# EAGLE design Power_Amp_V2.0 (EAGLE 6.5.0)
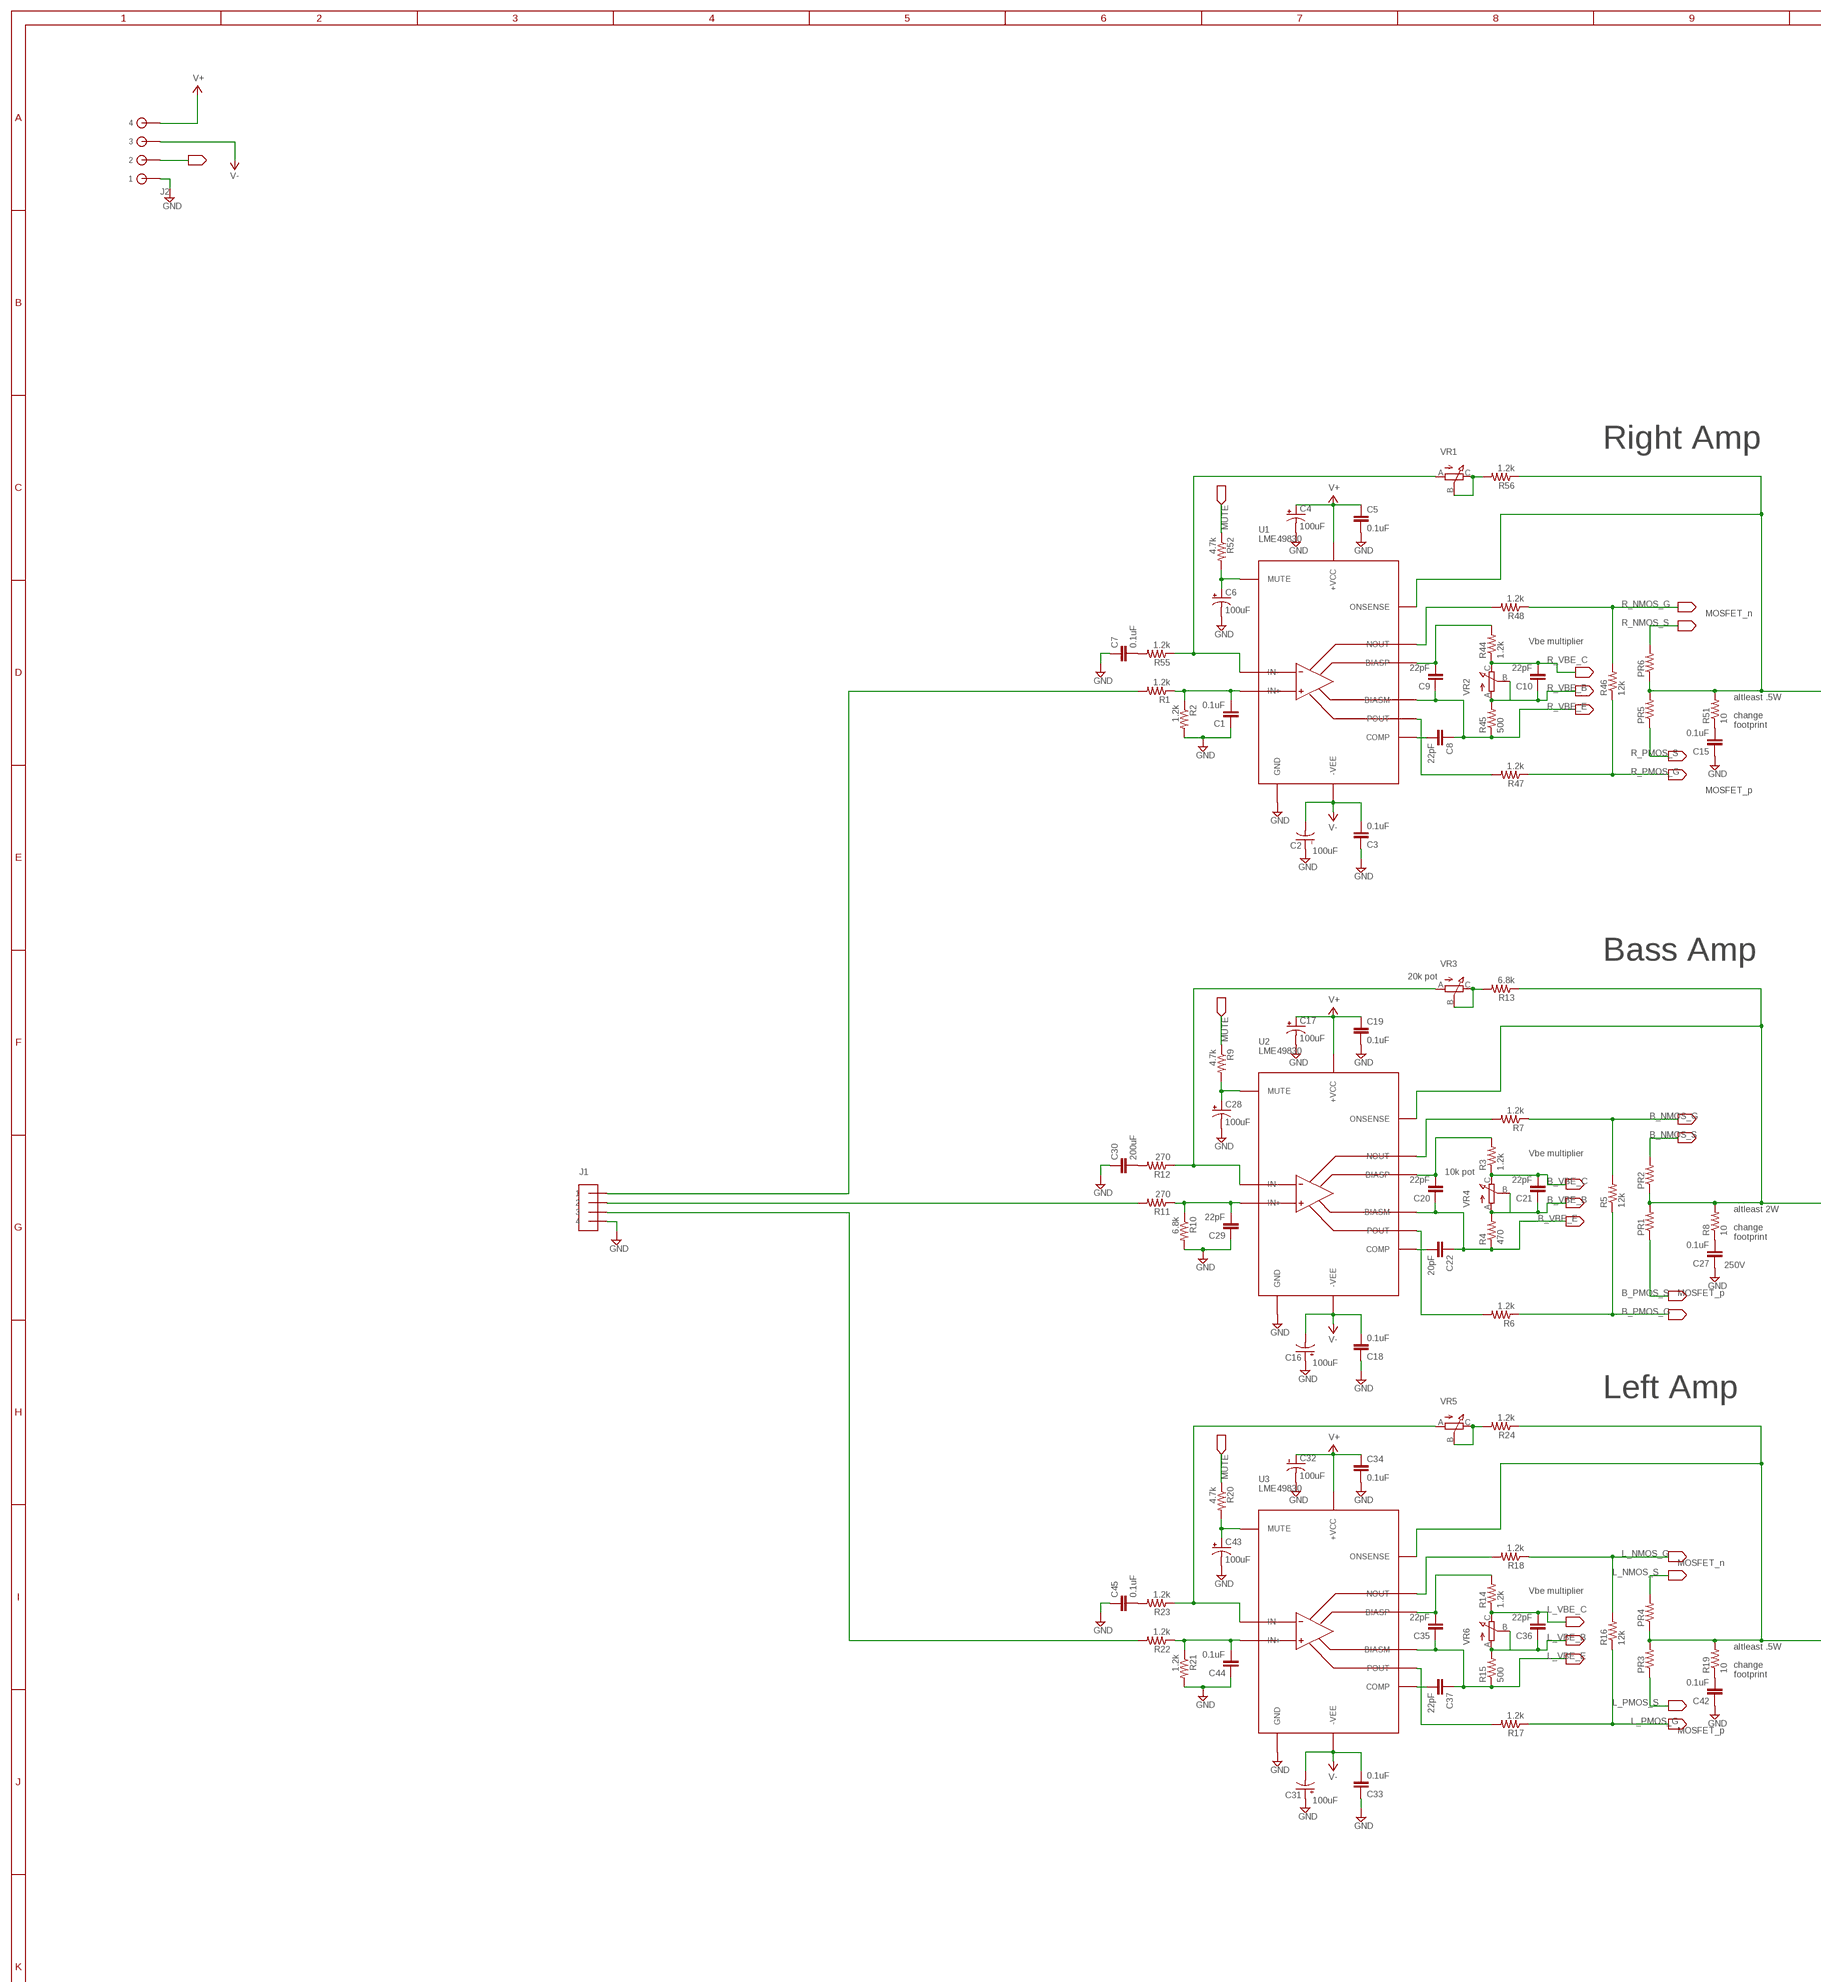
[diagram p0: schematic, sheet 1, part 1 of 3]
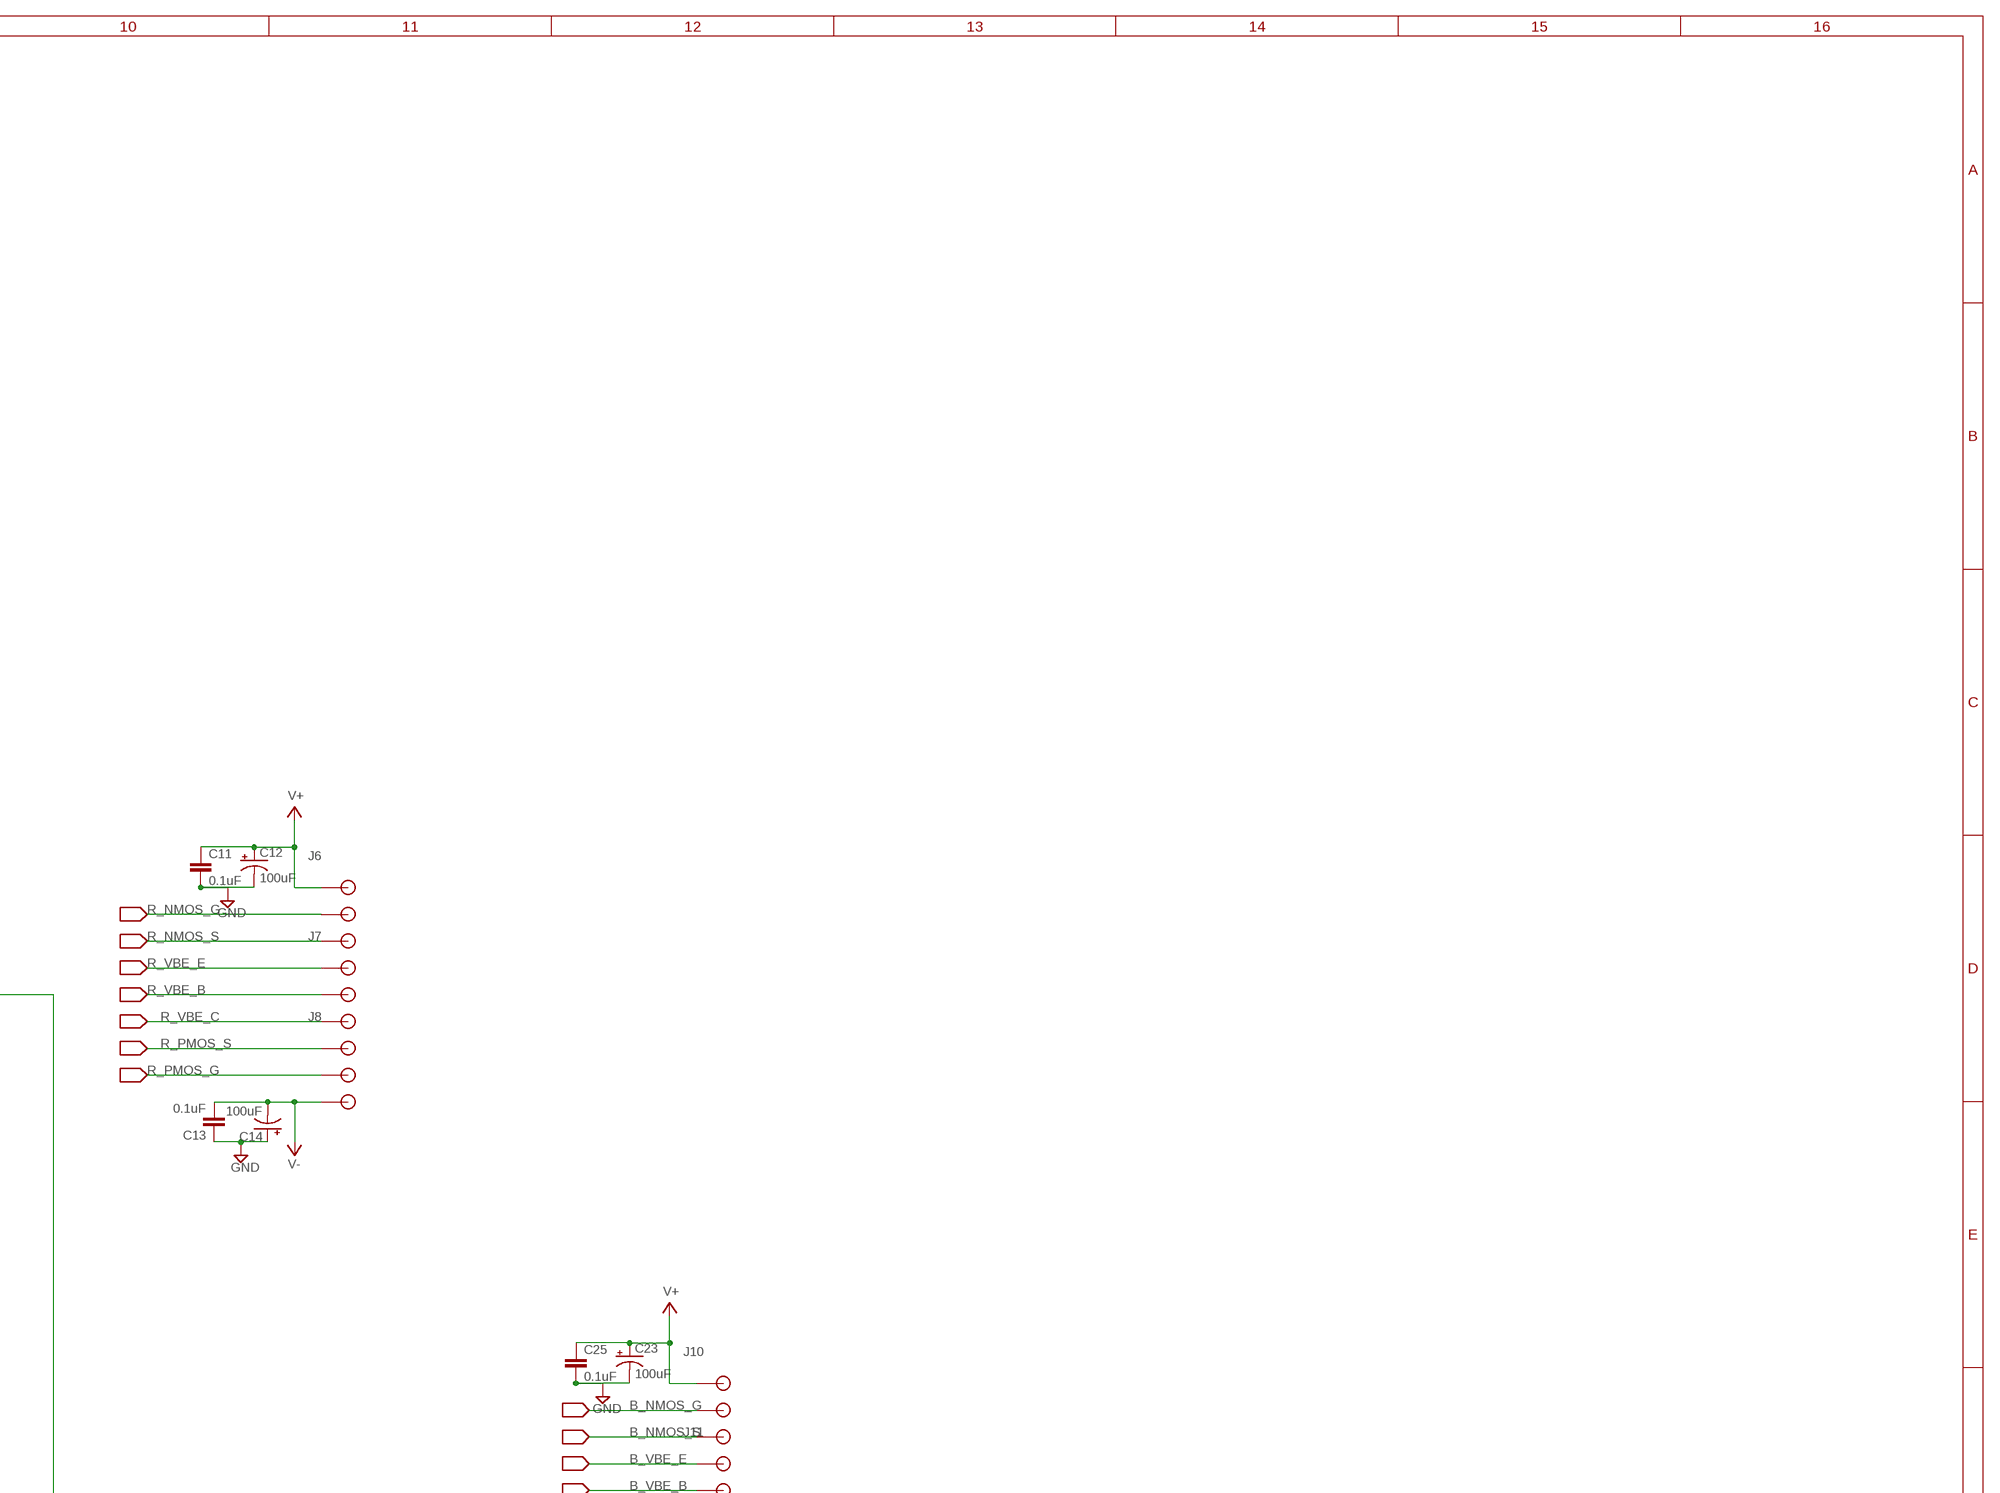
[diagram p1: schematic, sheet 1, part 2 of 3]
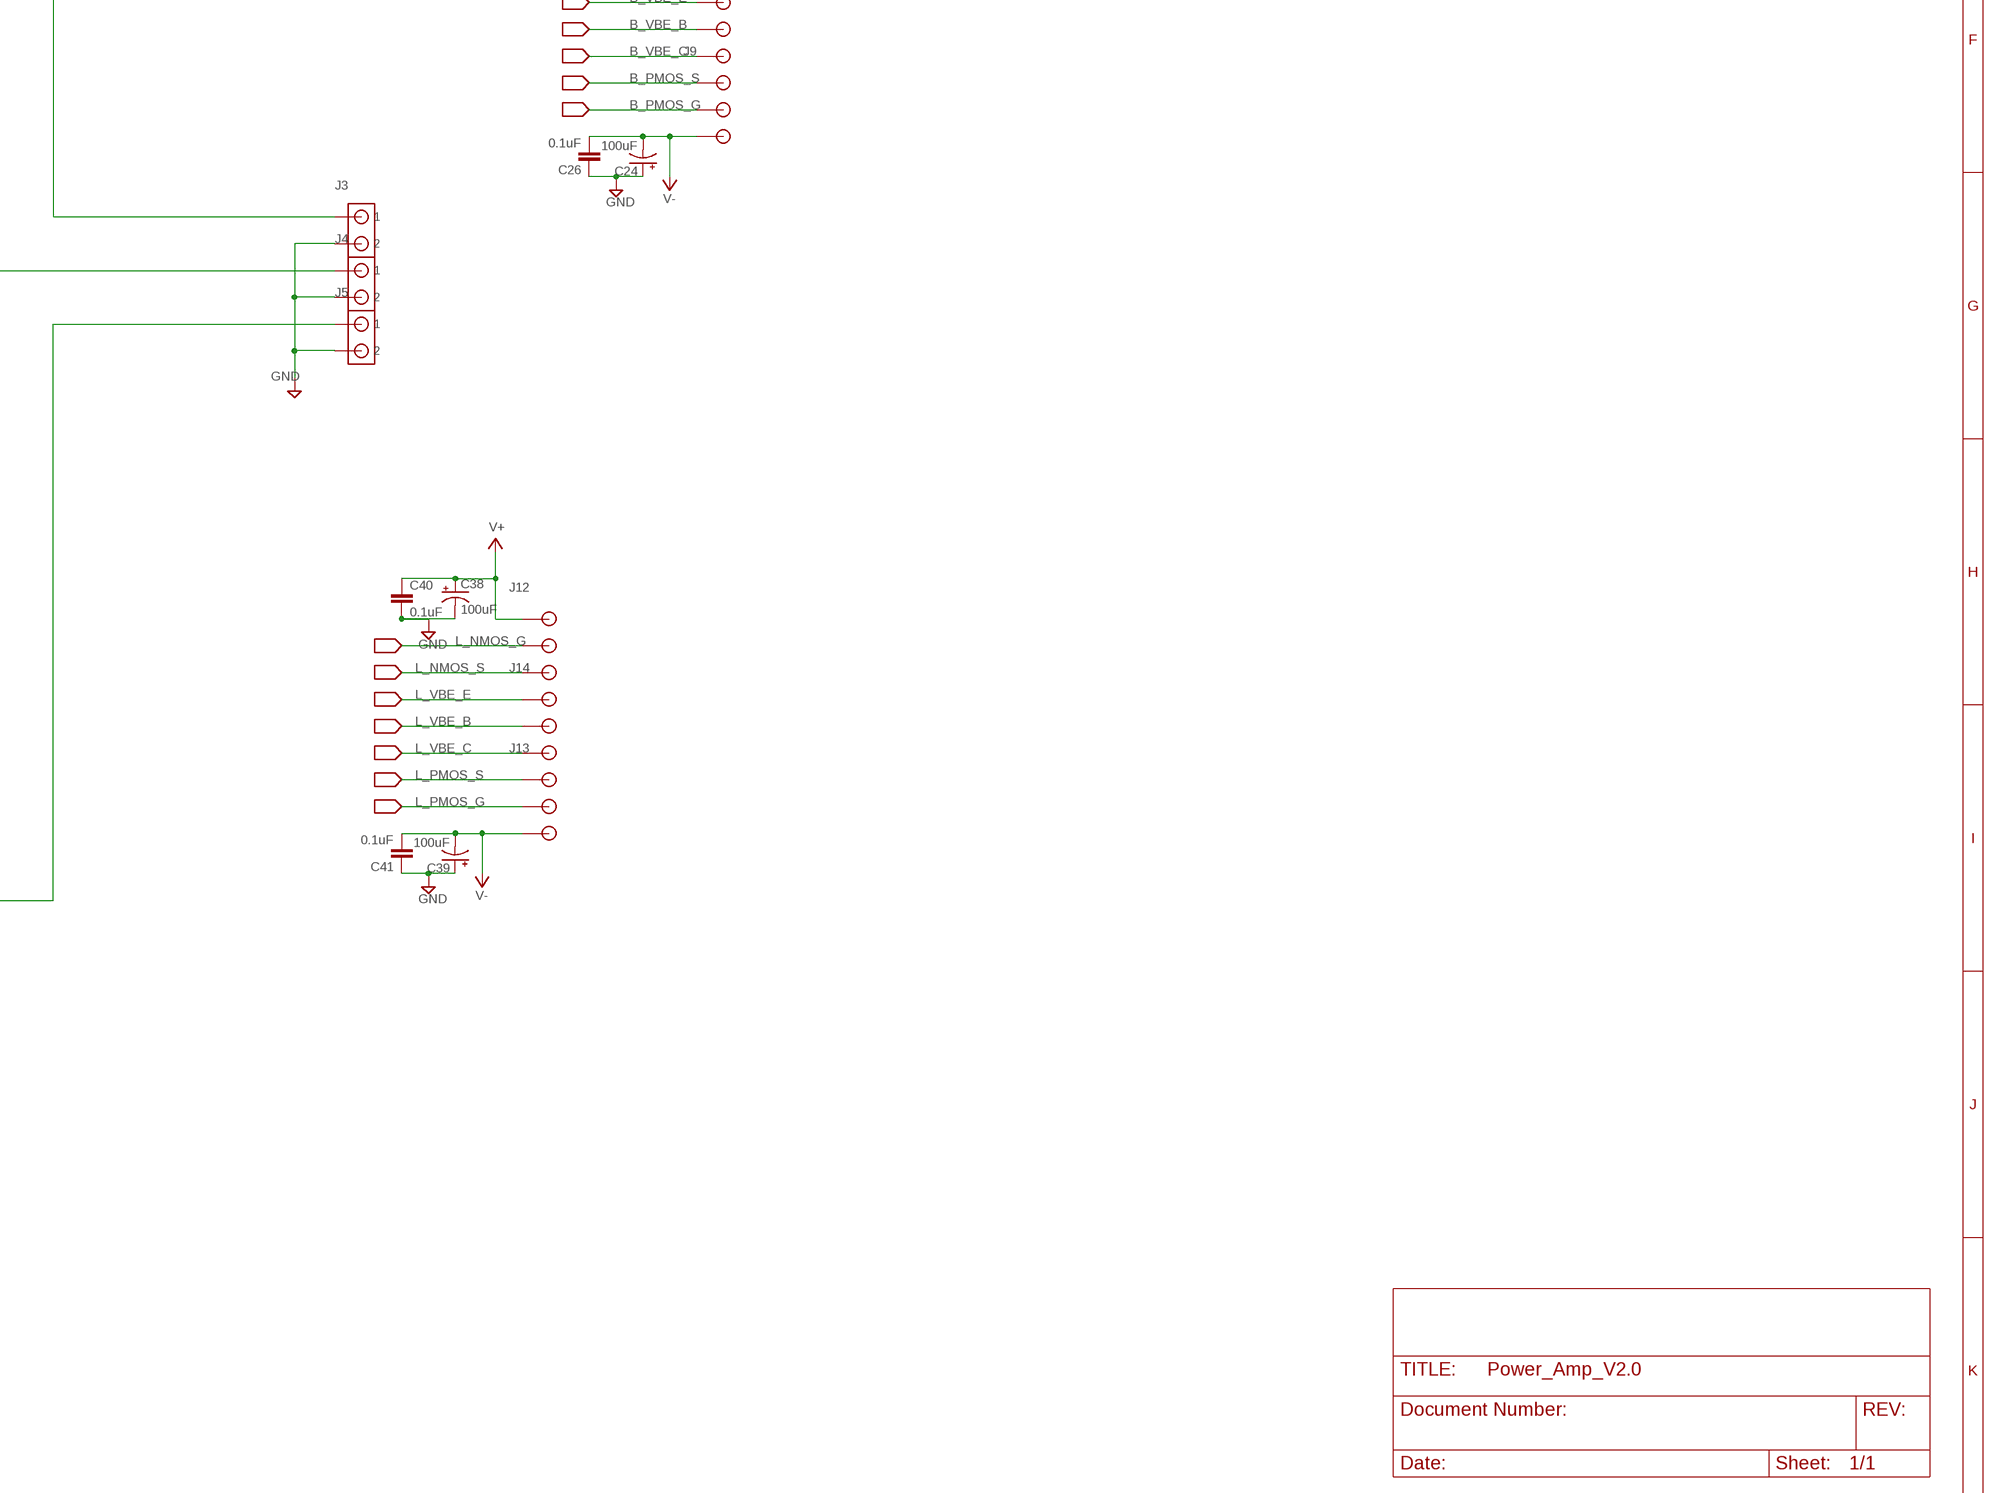
[diagram p2: schematic, sheet 1, part 3 of 3]

## Parts
C1  0.1uF  C-EU050-024X044  [C050-024X044]
C2  100uF  CPOL-USE2.5-6  [E2,5-6]
C3  0.1uF  C-EU050-024X044  [C050-024X044]
C4  100uF  CPOL-USE2.5-6  [E2,5-6]
C5  0.1uF  C-EU050-024X044  [C050-024X044]
C6  100uF  CPOL-USE2.5-6  [E2,5-6]
C7  0.1uF  C-EU050-024X044  [C050-024X044]
C8  22pF  C-EU050-024X044  [C050-024X044]
C9  22pF  C-EU050-024X044  [C050-024X044]
C10  22pF  C-EU050-024X044  [C050-024X044]
C11  0.1uF  C-EU050-024X044  [C050-024X044]
C12  100uF  CPOL-USE2.5-6  [E2,5-6]
C13  0.1uF  C-EU050-024X044  [C050-024X044]
C14  100uF  CPOL-USE2.5-6  [E2,5-6]
C15  0.1uF  C-EU050-024X044  [C050-024X044]
C16  100uF  CPOL-USE2.5-6  [E2,5-6]
C17  100uF  CPOL-USE2.5-6  [E2,5-6]
C18  0.1uF  C-EU050-024X044  [C050-024X044]
C19  0.1uF  C-EU050-024X044  [C050-024X044]
C20  22pF  C-EU050-024X044  [C050-024X044]
C21  22pF  C-EU050-024X044  [C050-024X044]
C22  20pF  C-EU050-024X044  [C050-024X044]
C23  100uF  CPOL-USE2.5-6  [E2,5-6]
C24  100uF  CPOL-USE2.5-6  [E2,5-6]
C25  0.1uF  C-EU050-024X044  [C050-024X044]
C26  0.1uF  C-EU050-024X044  [C050-024X044]
C27  0.1uF  C-EU050-024X044  [C050-024X044]
C28  100uF  CPOL-USE2.5-6  [E2,5-6]
C29  22pF  C-EU050-024X044  [C050-024X044]
C30  200uF  C-EU050-024X044  [C050-024X044]
C31  100uF  CPOL-USE2.5-6  [E2,5-6]
C32  100uF  CPOL-USE2.5-6  [E2,5-6]
C33  0.1uF  C-EU050-024X044  [C050-024X044]
C34  0.1uF  C-EU050-024X044  [C050-024X044]
C35  22pF  C-EU050-024X044  [C050-024X044]
C36  22pF  C-EU050-024X044  [C050-024X044]
C37  22pF  C-EU050-024X044  [C050-024X044]
C38  100uF  CPOL-USE2.5-6  [E2,5-6]
C39  100uF  CPOL-USE2.5-6  [E2,5-6]
C40  0.1uF  C-EU050-024X044  [C050-024X044]
C41  0.1uF  C-EU050-024X044  [C050-024X044]
C42  0.1uF  C-EU050-024X044  [C050-024X044]
C43  100uF  CPOL-USE2.5-6  [E2,5-6]
C44  0.1uF  C-EU050-024X044  [C050-024X044]
C45  0.1uF  C-EU050-024X044  [C050-024X044]
J1  4_PIN_AMPCONN  [4_PIN_AMPCON]
J2  1984633  [1984633]
J3  2TERMINAL_SPEAKER  [2TERMINAL_SPEAKER]
J4  2TERMINAL_SPEAKER  [2TERMINAL_SPEAKER]
J5  2TERMINAL_SPEAKER  [2TERMINAL_SPEAKER]
J6  OSTVN03A150  [OSTVN03A150]
J7  OSTVN03A150  [OSTVN03A150]
J8  OSTVN03A150  [OSTVN03A150]
J9  OSTVN03A150  [OSTVN03A150]
J10  OSTVN03A150  [OSTVN03A150]
J11  OSTVN03A150  [OSTVN03A150]
J12  OSTVN03A150  [OSTVN03A150]
J13  OSTVN03A150  [OSTVN03A150]
J14  OSTVN03A150  [OSTVN03A150]
PR1  R-US_0617/5V  [0617V]
PR2  R-US_0617/5V  [0617V]
PR3  R-US_0617/5V  [0617V]
PR4  R-US_0617/5V  [0617V]
PR5  R-US_0617/5V  [0617V]
PR6  R-US_0617/5V  [0617V]
R1  1.2k  R-US_0204/2V  [0204V]
R2  1.2k  R-US_0204/2V  [0204V]
R3  1.2k  R-US_0204/2V  [0204V]
R4  470  R-US_0204/2V  [0204V]
R5  12k  R-US_0204/2V  [0204V]
R6  1.2k  R-US_0204/2V  [0204V]
R7  1.2k  R-US_0204/2V  [0204V]
R8  10  R-US_0309/V  [0309V]
R9  4.7k  R-US_0204/2V  [0204V]
R10  6.8k  R-US_0204/2V  [0204V]
R11  270  R-US_0204/2V  [0204V]
R12  270  R-US_0204/2V  [0204V]
R13  6.8k  R-US_0204/2V  [0204V]
R14  1.2k  R-US_0204/2V  [0204V]
R15  500  R-US_0204/2V  [0204V]
R16  12k  R-US_0204/2V  [0204V]
R17  1.2k  R-US_0204/2V  [0204V]
R18  1.2k  R-US_0204/2V  [0204V]
R19  10  R-US_0309/V  [0309V]
R20  4.7k  R-US_0204/2V  [0204V]
R21  1.2k  R-US_0204/2V  [0204V]
R22  1.2k  R-US_0204/2V  [0204V]
R23  1.2k  R-US_0204/2V  [0204V]
R24  1.2k  R-US_0204/2V  [0204V]
R44  1.2k  R-US_0204/2V  [0204V]
R45  500  R-US_0204/2V  [0204V]
R46  12k  R-US_0204/2V  [0204V]
R47  1.2k  R-US_0204/2V  [0204V]
R48  1.2k  R-US_0204/2V  [0204V]
R51  10  R-US_0309/V  [0309V]
R52  4.7k  R-US_0204/2V  [0204V]
R55  1.2k  R-US_0204/2V  [0204V]
R56  1.2k  R-US_0204/2V  [0204V]
U1  LME49830  [NDN0015A]
U2  LME49830  [NDN0015A]
U3  LME49830  [NDN0015A]
VR1  EVM2W  [EVM2W]
VR2  EVM2W  [EVM2W]
VR3  EVM2W  [EVM2W]
VR4  EVM2W  [EVM2W]
VR5  EVM2W  [EVM2W]
VR6  EVM2W  [EVM2W]

## Nets
B_NMOS_G: J10.P$2 R5.2 R7.1
B_NMOS_S: J10.P$3 PR2.2
B_PMOS_G: J9.P$2 R5.1 R6.1
B_PMOS_S: J9.P$1 PR1.1
B_VBE_B: C21.1 J11.P$2 R4.2 VR4.A VR4.B
B_VBE_C: C21.2 J11.P$3 R3.1 VR4.C
B_VBE_E: C20.1 C22.1 J11.P$1 R4.1 U2.P11(BIASM)
BASS_IN: J1.2 R11.2
BASS_OUT: J4.P$1 PR1.2 PR2.1 R8.2 R13.1 U2.P$8(ONSENSE)
GND: C1.1 C2.+ C3.1 C4.- C5.2 C6.- C7.1 C11.2 C12.- C13.1 C14.+ C15.1 C16.+ C17.- C18.1 C19.2 C23.- C24.+ C25.2 C26.1 C27.1 C28.- C29.1 C30.1 C31.+ C32.- C33.1 C34.2 C38.- C39.+ C40.2 C41.1 C42.1 C43.- C44.1 C45.1 J1.4 J2.P$1 J3.P$2 J4.P$2 J5.P$2 R2.2 R10.2 R21.2 U1.P3(GND) U2.P3(GND) U3.P3(GND)
L_NMOS_G: J12.P$2 R16.2 R18.1
L_NMOS_S: J12.P$3 PR4.2
L_PMOS_G: J13.P$2 R16.1 R17.1
L_PMOS_S: J13.P$1 PR3.1
L_VBE_B: C36.1 J14.P$2 R15.2 VR6.A VR6.B
L_VBE_C: C36.2 J14.P$3 R14.1 VR6.C
L_VBE_E: C35.1 C37.1 J14.P$1 R15.1 U3.P11(BIASM)
LEFT_IN: J1.3 R22.2
LEFT_OUT: J5.P$1 PR3.2 PR4.1 R19.2 R24.1 U3.P$8(ONSENSE)
MUTE: J2.P$2 R9.1 R20.1 R52.1
N$3: C20.2 R3.2 U2.P12(BIASP)
N$4: R48.2 U1.P14(NOUT)
N$6: C22.2 U2.P6(COMP)
N$7: R6.2 U2.P13(POUT)
N$13: C27.2 R8.1
N$14: C28.+ R9.2 U2.P2(MUTE)
N$15: R7.2 U2.P14(NOUT)
N$16: C1.2 R1.1 R2.1 U1.P4(IN+)
N$17: C29.2 R10.1 R11.1 U2.P4(IN+)
N$18: C30.2 R12.2
N$19: R12.1 U2.P5(IN-) VR3.A
N$20: R13.2 VR3.B VR3.C
N$25: C35.2 R14.2 U3.P12(BIASP)
N$27: C37.2 U3.P6(COMP)
N$28: R17.2 U3.P13(POUT)
N$31: R55.1 U1.P5(IN-) VR1.A
N$35: C42.2 R19.1
N$36: C7.2 R55.2
N$37: C43.+ R20.2 U3.P2(MUTE)
N$38: R18.2 U3.P14(NOUT)
N$39: C44.2 R21.1 R22.1 U3.P4(IN+)
N$40: R56.2 VR1.B VR1.C
N$41: C45.2 R23.2
N$42: R23.1 U3.P5(IN-) VR5.A
N$43: R24.2 VR5.B VR5.C
N$66: C8.2 U1.P6(COMP)
N$69: C9.2 R44.2 U1.P12(BIASP)
N$70: R47.2 U1.P13(POUT)
N$84: C15.2 R51.1
N$85: C6.+ R52.2 U1.P2(MUTE)
R_NMOS_G: J6.P$2 R46.2 R48.1
R_NMOS_S: J6.P$3 PR6.2
R_PMOS_G: J8.P$2 R46.1 R47.1
R_PMOS_S: J8.P$1 PR5.1
R_VBE_B: C10.1 J7.P$2 R45.2 VR2.A VR2.B
R_VBE_C: C10.2 J7.P$3 R44.1 VR2.C
R_VBE_E: C8.1 C9.1 J7.P$1 R45.1 U1.P11(BIASM)
RIGHT_IN: J1.1 R1.2
RIGHT_OUT: J3.P$1 PR5.2 PR6.1 R51.2 R56.1 U1.P$8(ONSENSE)
V+: C4.+ C5.1 C11.1 C12.+ C17.+ C19.1 C23.+ C25.1 C32.+ C34.1 C38.+ C40.1 J2.P$4 J6.P$1 J10.P$1 J12.P$1 U1.P15(+VCC) U2.P15(+VCC) U3.P15(+VCC)
V-: C2.- C3.2 C13.2 C14.- C16.- C18.2 C24.- C26.2 C31.- C33.2 C39.- C41.2 J2.P$3 J8.P$3 J9.P$3 J13.P$3 U1.P10(-VEE) U2.P10(-VEE) U3.P10(-VEE)

## Notes on the sheet
- Right Amp
- MOSFET_n
- Vbe multiplier
- altleast .5W
- change
  footprint
- MOSFET_p
- Bass Amp
- 20k pot
- Vbe multiplier
- 10k pot
- altleast 2W
- change
  footprint
- 250V
- MOSFET_p
- Left Amp
- MOSFET_n
- Vbe multiplier
- altleast .5W
- change
  footprint
- MOSFET_p

## Library data of the parts
C1 C3 C5 C7-C11 C13 C15 C18-C22 C25-C27 C29 C30 C33-C37 C40-C42 C44 C45 = rcl:C-EU: CAPACITOR, European symbol
C2 C4 C6 C12 C14 C16 C17 C23 C24 C28 C31 C32 C38 C39 C43 = rcl:CPOL-US: POLARIZED CAPACITOR, American symbol
J1 = Amplifier_Parts:4_PIN_AMPCONN
J2 = Amplifier_Parts:1984633
J3-J5 = Amplifier_Parts:2TERMINAL_SPEAKER
J6-J14 = Amplifier_Parts:OSTVN03A150
PR1-PR6 R1-R24 R44-R48 R51 R52 R55 R56 = rcl:R-US_: RESISTOR, American symbol
U1-U3 = LME49830_1:LME49830: Mono High Fidelity 200 Volt MOSFET Power Amplifier Input Stage with Mute Datasheet: http://www.ti.com/lit/ds/symlink/lme49830.pdf
VR1-VR6 = Amplifier_Parts:EVM2W

## Board
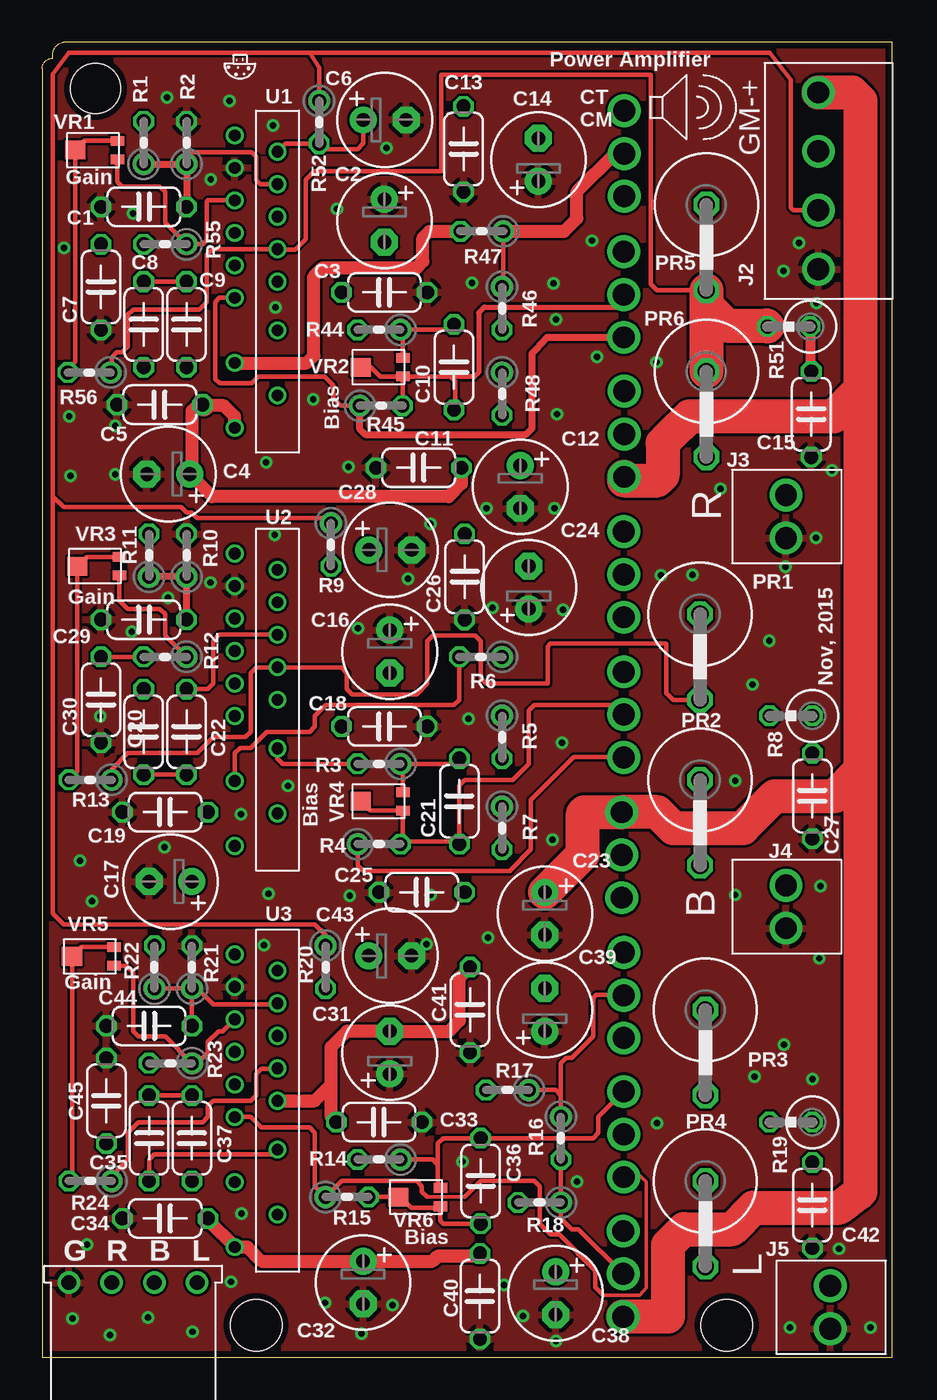
[diagram p3: board, top side]
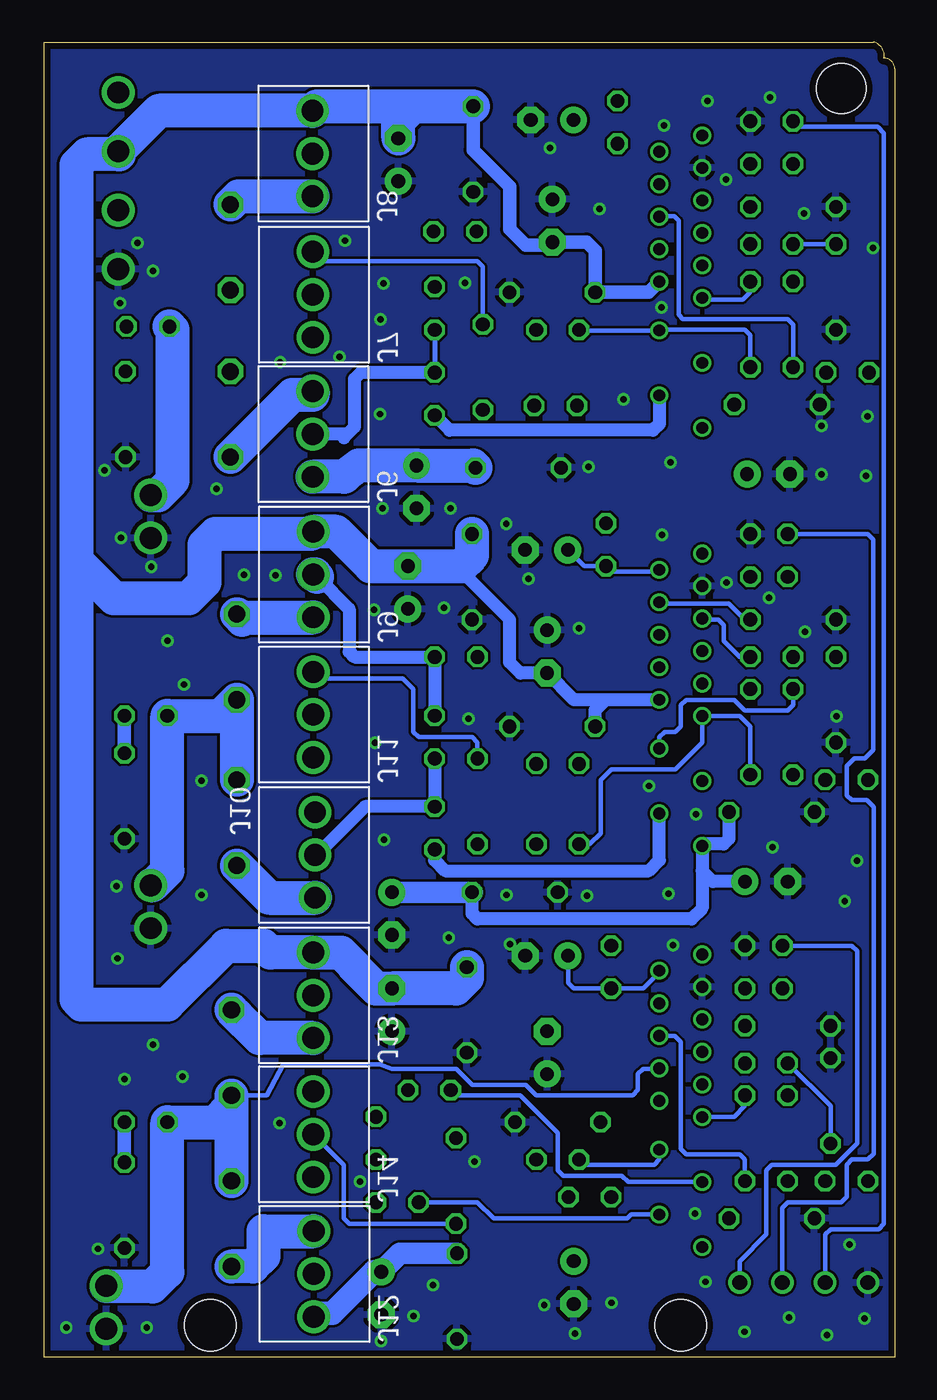
[diagram p4: board, bottom side, seen from below]

Size 50.47 x 78.11 mm. Coordinates in mm from the lower left corner, seen from the top.
Outline: 0,0 50.47,0 50.47,78.11 1.27,78.11 arc90 0.64,77.15 arc90 0,76.52 0,0
Copper layers (1*16): Top 0.0356mm / dielectric 1.5011mm / Bottom 0.0356mm
Design rules "LaenPCBOrder": minimum track width 6mil, minimum drill 13mil, track to track 6mil, track to pad 6mil, pad to pad 6mil, via to via 6mil, smd to smd 6mil, copper to edge 15mil, drill to drill 6mil, minimum pad ring 7mil, minimum via ring 7mil, stop-mask expansion 3mil, vias tented up to drill 0mil, thermal gap 10mil
Holes 3.05 mm at 12.7,1.91 40.64,1.9
Holes 2.95 mm at 3.17,75.36

### Footprints (pad centres in the part's own frame; a part is rotated, then mirrored left to right if it is on the bottom)
C050-024X044 = drill 0.813 octagon: 1 -2.54,0; 2 2.54,0
E2,5-6 = drill 0.813 pad 1.6: + -1.27,0 | drill 0.813 pad 1.6 octagon: - 1.27,0
4_PIN_AMPCON = drill 0.89: 1 1.27,0; 2 -1.27,0; 3 -3.81,0; 4 3.81,0
1984633 = drill 1.3: P$1 1.75,4.4; P$2 5.25,4.4; P$3 8.75,4.4; P$4 12.25,4.4
2TERMINAL_SPEAKER = drill 1.3: P$1 1.5,3.2; P$2 4.04,3.2
OSTVN03A150 = drill 1.3: P$1 1.5,3.2; P$2 4.04,3.2; P$3 6.58,3.2
0617V = drill 1.016 octagon: 1 -2.54,0; 2 2.54,0
0204V = drill 0.813 octagon: 1 -1.27,0; 2 1.27,0
0309V = drill 0.813 octagon: 1 -1.27,0; 2 1.27,0
NDN0015A = drill 0.7: P1 5.08,-8.685; P2 2.54,-7.72; P3 5.08,-6.755; P4 2.54,-5.79; P5 5.08,-4.825; P6 2.54,-3.86; P7 5.08,-2.895; P9 5.08,-0.965; P10 2.54,0; P11 5.08,0.965; P12 2.54,2.895; P13 5.08,4.825; P14 2.54,6.755; P15 5.08,8.685; P$8 2.54,-1.93
EVM2W = smd 0.575 x 0.8: A -0.55,-1.1; C 0.55,-1.1 | smd 1.1 x 1.2: B 0,1.4

### Placement (x,y rotation side)
C1  22pF  [C050-024X044]  6.03,68.33 0 top
C2  20.32,67.5 270 top
C3  20.32,63.25 180 top
C4  7.49,52.45 180 top
C5  6.99,56.58 180 top
C6  20.34,73.48 0 top
C7  200uF  [C050-024X044]  3.49,63.56 90 top
C8  6.03,61.34 270 top
C9  8.57,61.34 270 top
C10  24.45,58.8 90 top
C11  22.35,52.83 180 top
C12  28.38,51.69 270 top
C13  25.02,71.75 90 top
C14  29.46,71.12 90 top
C15  45.66,56.01 90 top
C16  20.64,41.91 270 top
C17  7.62,28.26 180 top
C18  20.32,37.47 180 top
C19  7.3,32.38 180 top
C20  6.03,37.15 90 top
C21  24.77,33.02 90 top
C22  22pF  [C050-024X044]  8.57,37.15 90 top
C23  29.84,26.35 270 top
C24  28.89,45.72 90 top
C25  22.54,27.62 180 top
C26  25.08,46.35 90 top
C27  45.72,33.34 90 top
C28  20.67,47.95 0 top
C29  6.03,43.81 0 top
C30  3.49,39.05 90 top
C31  20.64,18.1 90 top
C32  19.05,4.45 270 top
C33  20,13.97 180 top
C34  7.3,8.26 180 top
C35  6.35,13.02 270 top
C36  26.04,10.48 90 top
C37  8.89,13.02 270 top
C38  30.48,3.81 270 top
C39  29.84,20.64 90 top
C40  25.99,3.64 270 top
C41  25.4,20.64 90 top
C42  45.72,9.04 90 top
C43  20.66,23.85 0 top
C44  22pF  [C050-024X044]  6.35,19.68 0 top
C45  3.81,15.24 270 top
J1  5.4,4.45 180 top
J2  50.48,62.87 90 top
J3  40.96,52.7 270 top
J4  40.96,29.53 270 top
J5  43.59,5.75 270 top
J6  37.75,50.79 90 top
J7  37.73,59.07 90 top
J8  37.76,67.45 90 top
J9  37.72,42.45 90 top
J10  31.21,33.88 270 top
J11  37.72,34.13 90 top
J12  37.69,0.92 90 top
J13  37.72,17.46 90 top
J14  37.72,9.21 90 top
PR1  0.1  [0617V]  39.05,41.59 270 top
PR2  0.1  [0617V]  39.05,31.75 270 top
PR3  0.1  [0617V]  39.37,18.1 270 top
PR4  0.1  [0617V]  39.37,7.94 270 top
PR5  0.1  [0617V]  39.43,65.91 270 top
PR6  0.1  [0617V]  39.43,56.01 270 top
R1  240  [0204V]  6.03,72.14 90 top
R2  6.8k  [0204V]  8.57,72.14 90 top
R3  20,35.24 180 top
R4  500  [0204V]  20,30.48 0 top
R5  27.3,36.83 270 top
R6  120  [0204V]  26.04,41.59 180 top
R7  120  [0204V]  27.3,31.43 270 top
R8  44.45,38.1 180 top
R9  17.14,48.26 270 top
R10  8.57,47.62 90 top
R11  240  [0204V]  6.35,47.62 90 top
R12  240  [0204V]  7.3,41.59 180 top
R13  2.86,34.29 180 top
R14  20,11.75 180 top
R15  18.1,9.53 0 top
R16  30.8,13.02 270 top
R17  120  [0204V]  27.62,15.88 180 top
R18  120  [0204V]  29.53,9.21 180 top
R19  44.45,13.97 180 top
R20  16.83,23.18 270 top
R21  6.8k  [0204V]  8.89,23.18 90 top
R22  240  [0204V]  6.67,23.18 90 top
R23  240  [0204V]  7.62,17.46 180 top
R24  6.8k  [0204V]  2.86,10.48 180 top
R44  20,61.02 180 top
R45  20.13,56.52 0 top
R46  27.3,62.29 270 top
R47  120  [0204V]  26.1,66.87 180 top
R48  120  [0204V]  27.3,57.21 270 top
R51  44.32,61.21 180 top
R52  16.45,73.34 270 top
R55  240  [0204V]  7.3,66.1 180 top
R56  6.8k  [0204V]  2.79,58.48 180 top
U1  16.51,63.88 180 top
U2  16.51,39.05 180 top
U3  16.51,15.24 180 top
U$17  [MUSHROOM]  11.74,76.56 180 top
U$48  [SPEAKER]  35.58,74.24 0 top
VR1  20k  [EVM2W]  3.37,71.69 90 top
VR2  10k  [EVM2W]  20.32,58.8 90 top
VR3  20k  [EVM2W]  3.49,46.99 90 top
VR4  10k  [EVM2W]  20.32,33.02 90 top
VR5  20k  [EVM2W]  3.17,23.81 90 top
VR6  10k  [EVM2W]  22.54,9.53 90 top

### Tracks (layer width: path | path; a pad name or v marks a point on that pad's centre or on a via)
B_NMOS_G
  Bottom 0.762: R5.2 R7.1 31.43,32.7 34.3,29.84 J10.P$2
B_NMOS_S
  Bottom 2.032: PR2.2 37.14,27.3 J10.P$3
B_PMOS_G
  Bottom 0.762: 34.29,46.35 32.38,44.45 32.38,41.91 32.07,41.59 R6.1 R5.1
  Bottom 2.032: 34.29,46.35 34.42,46.49 J9.P$2
B_PMOS_S
  Bottom 2.032: PR1.1 38.73,43.81 38.6,43.95 J9.P$1
B_VBE_B
  Top 0.254: VR4.B 19.47,32.47 VR4.A 21.42,30.63 | 21.42,30.63 R4.2 | 21.42,30.63 24.62,30.63 C21.1 24.77,33.97 25.08,34.29 27.94,34.29 28.89,35.24 28.89,38.42 29.21,38.73 33.95,38.73 J11.P$2
B_VBE_C
  Top 0.254: VR4.C 21.42,35.09 R3.1 24.45,35.24 C21.2
  Bottom 0.254: C21.2 24.77,36.51 25.08,36.83 28.26,36.83 28.57,37.15 28.57,39.69 29.21,40.32 34.13,40.32 J11.P$3
B_VBE_E
  Top 0.254: C20.1 C22.1 | R4.1 18.73,29.21 19.05,28.89 27.78,28.89 27.78,28.92 29.02,30.16 29.02,33.12 31.56,35.66 34.49,35.66 J11.P$1
  Bottom 0.254: C22.1 8.57,37.47 9.21,38.1 11.42,38.1 U2.P11 11.43,36.51 13.02,34.92 16.83,34.92 17.46,34.29 17.46,31.11 18.1,30.48 R4.1
BASS_IN
  Bottom 0.254: R11.2 1.59,48.9 1.27,48.58 1.27,36.07 1.77,35.56 2.39,35.56 2.84,35.11 2.84,33.37 2.56,33.09 1.65,33.09 1.24,32.67 1.24,12.09 1.59,11.75 2.54,11.75 2.86,11.43 2.86,9.53 3.17,9.21 6.35,9.21 6.67,8.89 J1.2
BASS_OUT
  Top 0.254: R13.1 4.13,34.92 5.08,35.88 9.21,35.88 10.16,36.83 12.06,36.83 12.38,37.15 12.38,40.64 12.7,40.96 13.95,40.96 U2.P$8 13.99,40.96 17.78,40.96 18.1,40.64 18.1,39.69 18.41,39.37 22.23,39.37 22.86,40.01 22.86,42.55 23.18,42.86 25.72,42.86 26.04,42.55 26.04,40.32 26.35,40.01 30,40.01 30,42.23 30.16,42.39 37.02,42.39 37.05,42.35 37.05,39.47 37.47,39.05 PR1.2
  Bottom 2.032: PR1.2 PR2.1 | PR1.2 39.05,37.15 | J4.P$1 44.05,28.03 43.18,28.89 R8.2 40.01,38.1 PR1.2
GND  (via drill 0.38)
  other vias: 20.45,71.82 13.7,73.17 11.11,74.6 7.41,74.81 1.29,65.88 1.61,55.89 1.7,52.35 5.32,43.1 7.47,45.11 9.99,46.01 21.73,46.24 13.81,48.84 23.06,49.5 18.74,43.31 30.92,44.38 26.74,44.51 26.37,50.43 30.41,50.43 36.74,46.43 38.62,46.47 45.94,48.66 44.13,46.94 42.18,39.96 43.16,42.55 46.19,27.97 46.13,23.69 47.29,6.45 49.17,1.77 27.42,4.31 30.49,0.97 28.56,2.45 20.8,3.12 18.97,1.41 16.8,3.24 11.84,8.54 13.17,24.47 1.8,2.3 2.67,6.7 25.31,37.92 11.79,32.26 14.59,33.93 2.97,27.09 2.25,29.48 7.26,30.3 3.45,38.08 4.34,52.43 4.34,55.31 13.3,53.14 18.18,52.89 30.35,63.77 30.52,61.63 30.56,56.02 32.95,59.41 44.02,64.52 44.94,66.19 45.98,62.6 46.9,52.68 40.26,51.57 36.48,59.1 32.64,66.31 25.51,63.81 17.51,68.19 16.09,56.89 13.84,62.35 10.01,69.94 5.38,67.94 13.43,27.54 18.26,27.42 23.06,27.46 26.47,24.92 30.85,36.51 30.31,30.75 41.14,34.26 41.14,27.46 6.27,2.37 11.22,4.49 4.02,1.32 8.92,1.52 36.51,13.92 45.73,16.53 42.28,16.68 44.03,18.58 22.83,24.54 24.95,11.62 31.75,10.43 44.4,1.77
  pour Bottom: -3.49,0.32 51.75,0 53.47,78.96 -3.81,78.74
  pour Top: 51.5,-0.76 -3.75,0.19 -3.75,78.61 53.28,79.28
L_NMOS_G
  Top 0.254: R16.2 R18.1 30.8,8.26 31.43,7.62 31.83,7.62 J12.P$2
L_NMOS_S
  Bottom 2.032: PR4.2 38.1,5.4 37.47,6.03 37.47,7.5 J12.P$3
L_PMOS_G
  Top 0.254: 30.8,15.56 R16.1 | R17.1 30.48,15.88 30.8,15.56 | 30.8,15.56 30.8,17.46 31.11,17.78 31.43,17.78 32.7,19.05 32.7,21.34 32.89,21.53 34.49,21.53 J13.P$2
L_PMOS_S
  Bottom 2.032: 39.05,20.32 PR3.1 37.7,18.96 J13.P$1
L_VBE_B
  Top 0.254: C36.1 23.81,7.94 23.64,8.11 VR6.A 23.56,8.89 21.91,8.89 21.27,9.53 VR6.B R15.2
  Bottom 0.254: C36.1 32.38,7.94 32.7,8.26 32.7,11.43 J14.P$2
L_VBE_C
  Top 0.254: R14.1 23.18,11.75 23.5,11.43 | 23.5,11.43 23.5,10.22 VR6.C | 23.5,11.43 23.5,12.7 23.81,13.02 C36.2 32.7,13.02 33.02,13.34 33.02,14.29 J14.P$3
L_VBE_E
  Top 0.203: 25.08,9.53 22.86,9.53 | 33.3,3.69 35.46,3.69 35.87,4.13 35.87,10.42 35.54,10.75 34.56,10.75
  Top 0.254: C35.1 C37.1 | U3.P11 12.39,14.28 13.02,13.65 15.88,13.65 16.19,13.34 16.19,10.16 R15.1 17.78,10.48 22.23,10.48 22.54,10.16 22.54,9.84 22.86,9.53 | 25.08,9.53 26.04,10.48 29.21,10.48 29.53,10.16 29.53,7.94 30.16,7.3 30.69,7.3 32.85,5.15 32.85,4.17 33.3,3.69 | 34.52,10.76 J14.P$1 34.56,10.75
  Bottom 0.254: C37.1 8.89,14.92 9.53,14.29 11.42,14.29 U3.P11
LEFT_IN
  Bottom 0.254: R22.2 2.54,24.45 2.22,24.13 2.22,12.7 3.49,11.43 7.3,11.43 7.62,11.11 7.62,7.3 9.21,5.71 J1.3
LEFT_OUT
  Top 0.254: R24.1 4.13,10.79 5.08,11.75 5.08,13.34 5.71,13.97 9.53,13.97 9.84,14.29 9.84,14.92 10.16,15.24 12.38,15.24 12.7,15.56 12.7,16.83 13.02,17.14 13.95,17.14 U3.P$8
  Bottom 0.254: PR3.2 37.27,15.56 36.29,17.4 30.57,17.4 29.84,17.14 26.04,17.14 25.08,16.19 21.91,16.19 21.27,15.56 15.56,15.56 15.24,15.88 15.24,16.83 14.92,17.14 13.99,17.14 U3.P$8
  Bottom 2.032: PR3.2 39.37,14.92 | 39.37,14.92 PR4.1 | 39.37,14.92 40.32,13.97 R19.2 43.18,5.08 44.05,4.21 J5.P$1
MUTE
  Top 0.254: J2.P$2 44.6,68.11 44.45,68.26 44.45,75.88 43.18,77.47 15.88,77.47 | 0.64,51.12 0.64,76.2 1.59,77.47 15.88,77.47 | 0.64,51.12 1.27,50.48 8.26,50.48 8.57,50.16 8.89,50.16 9.21,49.85 16.83,49.85 R9.1 | 0.64,51.12 0.64,26.35 1.27,25.72 16.19,25.72 16.83,25.08 R20.1 | R52.1 16.45,76.58 15.88,77.47
N$3
  Top 0.254: U2.P12 13.97,35.56 14.29,35.24 R3.2
  Bottom 0.254: C20.2 6.03,38.73 6.35,38.42 8.89,38.42 9.53,39.05 12.38,39.05 12.7,38.73 12.7,37.47 13.02,37.15 13.65,37.15 13.97,36.83 U2.P12
N$4
  Bottom 0.762: U1.P14 13.97,55.44 14.35,55.05 26.42,55.05 R48.2
N$6
  Top 0.254: U2.P6 10.53,42.91 10.16,42.55 10.16,40.01 9.84,39.69 C22.2
N$7
  Top 0.254: U2.P13 11.43,35.88 11.75,36.2 12.38,36.2 13.34,37.15 15.88,37.15 16.19,37.47 16.19,38.1 16.83,38.73 24.45,38.73 24.77,39.05 R6.2
N$13
  Bottom 0.813: R8.1 C27.2
N$14
  Bottom 0.254: U2.P2 14.07,46.67 16.83,46.67 R9.2 18.44,46.99 C28.+
N$15
  Bottom 0.762: R7.2 27.3,29.53 26.67,28.89 14.61,28.89 13.97,29.53 U2.P14
N$16
  Top 0.254: R2.1 8.57,71.25 8.89,71.56 12.45,71.56 12.7,71.31 12.7,69.91 12.95,69.66 13.96,69.66 U1.P4
  Top 0.406: R1.1 R2.1 C1.2
N$17
  Top 0.406: C29.2 R10.1 R11.1
  Bottom 0.254: C29.2 8.89,43.81 9.84,44.77 13.89,44.77 U2.P4
N$18
  Top 0.254: C30.2 R12.2
N$19
  Top 0.254: VR3.A 4.59,44.94 5.08,44.45 6.99,44.45 7.3,44.13 7.3,42.86 R12.1
  Bottom 0.254: R12.1 9.21,41.59 10.16,42.55 10.16,43.5 10.48,43.81 11.37,43.81 U2.P5
N$20
  Top 0.254: VR3.C 2.64,47.54 VR3.B 2.09,34.8 R13.2
N$25
  Top 0.254: C35.2 6.35,11.75 6.67,12.06 13.69,12.06 U3.P12
  Bottom 0.254: U3.P12 13.97,11.75 14.29,11.43 18.41,11.43 R14.2
N$27
  Bottom 0.254: U3.P6 13.07,19.1 12.7,18.73 12.7,12.38 12.38,12.06 9.21,12.06 8.89,11.75 C37.2
N$28
  Bottom 0.254: U3.P13 15.81,10.41 16.19,10.79 19.68,10.79 20,11.11 20,13.34 22.23,15.56 26.04,15.56 R17.2
N$31
  Top 0.254: U1.P5 9.84,68.71 9.78,68.64 9.78,66.36 9.53,66.1 R55.1 7.3,67.37 7.3,69.22 6.99,69.53 4.76,69.53 4.46,69.83 VR1.A
N$35
  Bottom 0.813: R19.1 C42.2
N$36
  Bottom 0.254: C7.2 R55.2
N$37
  Bottom 0.254: U3.P2 13.97,22.86 14.92,21.91 R20.2 19.05,21.91 19.37,22.23 19.37,23.82 C43.+
N$38
  Bottom 0.254: U3.P14 15.64,8.48 15.88,8.26 23.81,8.26 24.77,9.21 R18.2
N$39
  Top 0.254: R22.1 R21.1 | R21.1 C44.2 | R21.1 9.21,21.91 10.16,20.95 13.89,20.95 U3.P4
N$40
  Top 0.254: VR1.C 2.52,72.24 VR1.B 1.97,59.12 R56.2
N$41
  Bottom 0.254: C45.2 3.81,14.92 R23.2
N$42
  Top 0.254: VR5.A 5,23.26 5.4,22.86 5.4,19.37 5.71,19.05 7.3,19.05 R23.1 9.21,17.46 9.84,18.1 9.84,18.73 10.48,19.37 10.73,19.37 U3.P5
N$43
  Top 0.254: VR5.C 2.33,24.36 VR5.B 1.77,10.66 R24.2
N$66
  Bottom 0.254: C8.2 6.03,61.34 6.35,61.66 12.57,61.66 12.83,61.91 12.83,67.5 13.08,67.75 13.96,67.75 U1.P6
N$69
  Bottom 0.254: C9.2 8.57,60.71 8.89,61.02 13.93,61.02 U1.P12 18.7,60.99 R44.2
N$70
  Top 0.762: U1.P13 15.69,59.06 16.13,59.5 16.13,64.2 16.64,64.71 22.23,64.71 22.61,65.09 22.61,66.48 22.99,66.86 R47.2
N$84
  Top 0.584: R51.1 45.59,58.61 C15.2
N$85
  Top 0.254: C6.+ 19.07,72.09 18.73,71.75 16.76,71.75 R52.2 14.44,72.07 U1.P2
R_NMOS_G
  Bottom 0.305: R46.2 R48.1
  Bottom 0.762: R48.1 31.69,58.48 32.07,58.1 32.07,55.24 32.7,54.61 32.7,54.83 J6.P$2
R_NMOS_S
  Bottom 2.032: PR6.2 35.75,57.15 34.55,57.15 J6.P$3
R_PMOS_G
  Top 0.254: R47.1 27.37,63.63 R46.1
  Top 0.762: R47.1 30.99,66.86 31.75,67.63 31.75,69.22 34.02,71.49 J8.P$2
  Bottom 0.305: 27.37,63.63 R46.1
R_PMOS_S
  Bottom 2.032: PR5.1 38.94,68.95 J8.P$1
R_VBE_B
  Top 0.254: VR2.B 19.49,58.8 20.07,58.23 21.4,58.23 | 21.4,58.23 VR2.A 24.23,58.25 24.51,57.98 24.51,56.33 C10.1 | 21.4,58.23 R45.2
  Top 0.305: 24.23,58.25 24.26,58.23 25.65,58.23 25.91,58.48 25.91,62.04 26.25,62.38 34.53,62.38 J7.P$2
R_VBE_C
  Top 0.254: VR2.C 21.42,60.88 R44.1 24.13,61.02 C10.2
  Bottom 0.254: C10.2 24.45,64.77 24.77,65.09 34.53,65.09 J7.P$3
R_VBE_E
  Top 0.254: C8.1 C9.1 | U1.P11 10.53,62.92 10.29,62.67 10.29,58.1 10.54,57.85 12.45,57.85 12.83,58.23 16.76,58.23 17.27,57.72 17.27,56.96 17.72,56.52 R45.1
  Top 0.406: R45.1 18.86,55.12 19.18,54.8 28.7,54.8 29.08,55.18 29.08,59.63 29.34,59.88 29.97,60.57 J7.P$1
  Bottom 0.254: C9.1 8.57,63.25 9.02,62.8 11.32,62.8 U1.P11
RIGHT_IN
  Bottom 0.254: J1.1 4.13,7.3 3.81,7.62 0.95,7.62 0.64,7.94 0.64,72.71 1.02,73.09 5.71,73.09 R1.2
RIGHT_OUT
  Top 0.254: R56.1 4.13,58.55 4.13,59.37 4.45,59.69 4.76,59.69 5.08,60.01 5.08,61.91 5.4,62.23 9.34,62.23 9.78,62.67 9.78,65.47 10.12,65.81 U1.P$8 13.99,65.79 15.04,65.79 15.64,66.39 15.64,69.92 16.17,70.45 23.69,70.45 23.69,76.17 36.13,76.17 36.13,70.56 36.13,63.73 36.49,63.37 PR5.2
  Top 0.584: PR6.1 39.43,60.71 39.69,60.96 43.18,60.96
  Top 2.032: PR6.1 PR5.2 39.43,62.48 40.64,61.28 42.99,61.28 R51.2
  Bottom 2.032: J3.P$1 43.73,51.2 42.86,52.07 42.86,61.02 R51.2
V+
  Top 0.254: 37.15,54.61 38.73,56.2 46.99,56.2 46.99,56.52 48.58,58.1
  Top 0.762: U1.P15 11.43,55.88 10.79,56.52 9.59,56.52 | C5.1 9.27,56.58 8.89,56.2 8.89,52.58 | C34.1 9.84,8.14 U3.P15 12.18,6.55 13.02,5.71 C32.+ 23.18,5.71 23.5,6.03 25.84,6.03 C40.1 | C11.1 24.89,51.88 24.13,51.12 10.1,51.12 C4.+
  Top 1.27: 9.59,56.52 C5.1 | 8.89,52.58 C4.+
  Top 2.032: J2.P$4 48.08,75.11 48.58,74.61 48.58,58.1 48.58,57.47 | 48.58,57.47 46.99,55.88 38.42,55.88 37.15,54.61 36.83,54.29 36.83,52.39 36.51,52.07 34.55,52.07 J6.P$1 | 48.41,9.72 47.31,8.89 42.23,8.89 40.96,7.62 38.1,7.62 37.15,6.67 37.15,2.42 J12.P$1 | 48.41,9.72 48.58,9.84 | 48.58,57.47 48.58,34.87 | 48.58,34.87 48.58,9.88 48.41,9.72 | 48.58,34.87 47.04,33.34 43.5,33.34 41.59,31.43 37.47,31.43 36.52,32.38 J10.P$1 32.19,32.38 32.1,32.29 32.1,29.88 C23.+
  Bottom 0.762: C19.1 9.84,30.8 10.16,30.48 11.32,30.48 U2.P15 11.43,28.89 | 11.43,28.89 11.43,26.67 12.06,26.04 24.77,26.04 25.08,26.35 C25.1 | C17.+ 10.79,28.26 11.43,28.89
  Bottom 1.27: C25.1 C23.+ | C40.1 29.38,6.18 C38.+
  Bottom 1.397: C38.+ 30.92,5.08 33.39,2.61 34.3,2.61 J12.P$1
  Bottom 2.032: C11.1 25.02,52.96 C12.+ 31.81,52.96 32.64,52.32 32.7,52.29 J6.P$1
V-
  Top 0.762: 17.14,16.19 17.14,18.41 18.1,19.37 C31.- 24.13,19.37 24.77,20 24.77,22.54 C41.2 | 17.14,16.19 17.14,14.29 C33.2 | U3.P10 16.19,15.24 17.14,16.19
  Bottom 0.254: 45.4,72.07 46.04,71.44
  Bottom 0.762: U2.P10 17.14,39.05 | 17.14,39.05 19.05,39.05 C16.- 22.23,40.64 22.86,41.27 22.86,43.81 26.04,46.99 | C18.2 17.78,38.42 17.14,39.05
  Bottom 0.813: C13.2 25.02,71.69 22.86,69.53 22.86,66.99 21.91,66.04 20.51,66.04 C2.- 18.29,66.23 17.78,65.72 C3.2 14.61,63.25 U1.P10
  Bottom 2.032: 48.58,47.31 48.58,70.8 47.94,71.44 46.04,71.44 46.04,71.57 J2.P$3 43.67,74.03 J8.P$3 34.29,74.3 28.57,74.3 | 48.58,47.31 48.58,21.27 48.26,20.95 43.18,20.95 39.69,24.45 37.47,24.45 37.06,24.04 J13.P$3 32.87,24.04 32.1,23.27 32.1,23.21 30.8,21.91 C39.- 26.04,21.91 25.4,22.54 C41.2 | C14.- 29.46,73.41 28.57,74.3 | 28.57,74.3 C13.2 | C26.2 25.08,47.62 25.72,46.99 26.04,46.99 C24.- 31.11,46.99 33.16,49.03 J9.P$3 34.65,48.9 40.32,48.9 40.96,48.26 40.96,46.04 41.91,45.09 46.35,45.09 48.58,47.31

### Text on the board
tPlace: Power Amplifier | CT / CM | GM-+ | Gain | Bias | R | Gain | Nov, 2015 | Bias | B | Gain | Bias | G | R | B | L | L